# Altium schematic sheet Sheet2.SchDoc: =Name-1str
size 594 x 420 mm; SheetNumber: номер страницы; Вид изделия: Документация; Раздел: Документация; Код документа: Э3; Вид документа: Схема электрическая принципиальная; Класс документа: Конструкторский документ; Создавать изделие в PLM: Yes; DocumentCode: Э3; DocumentView: Схема электрическая принципиальная; DocumentClass: Конструкторский документ; ProductView: Документация
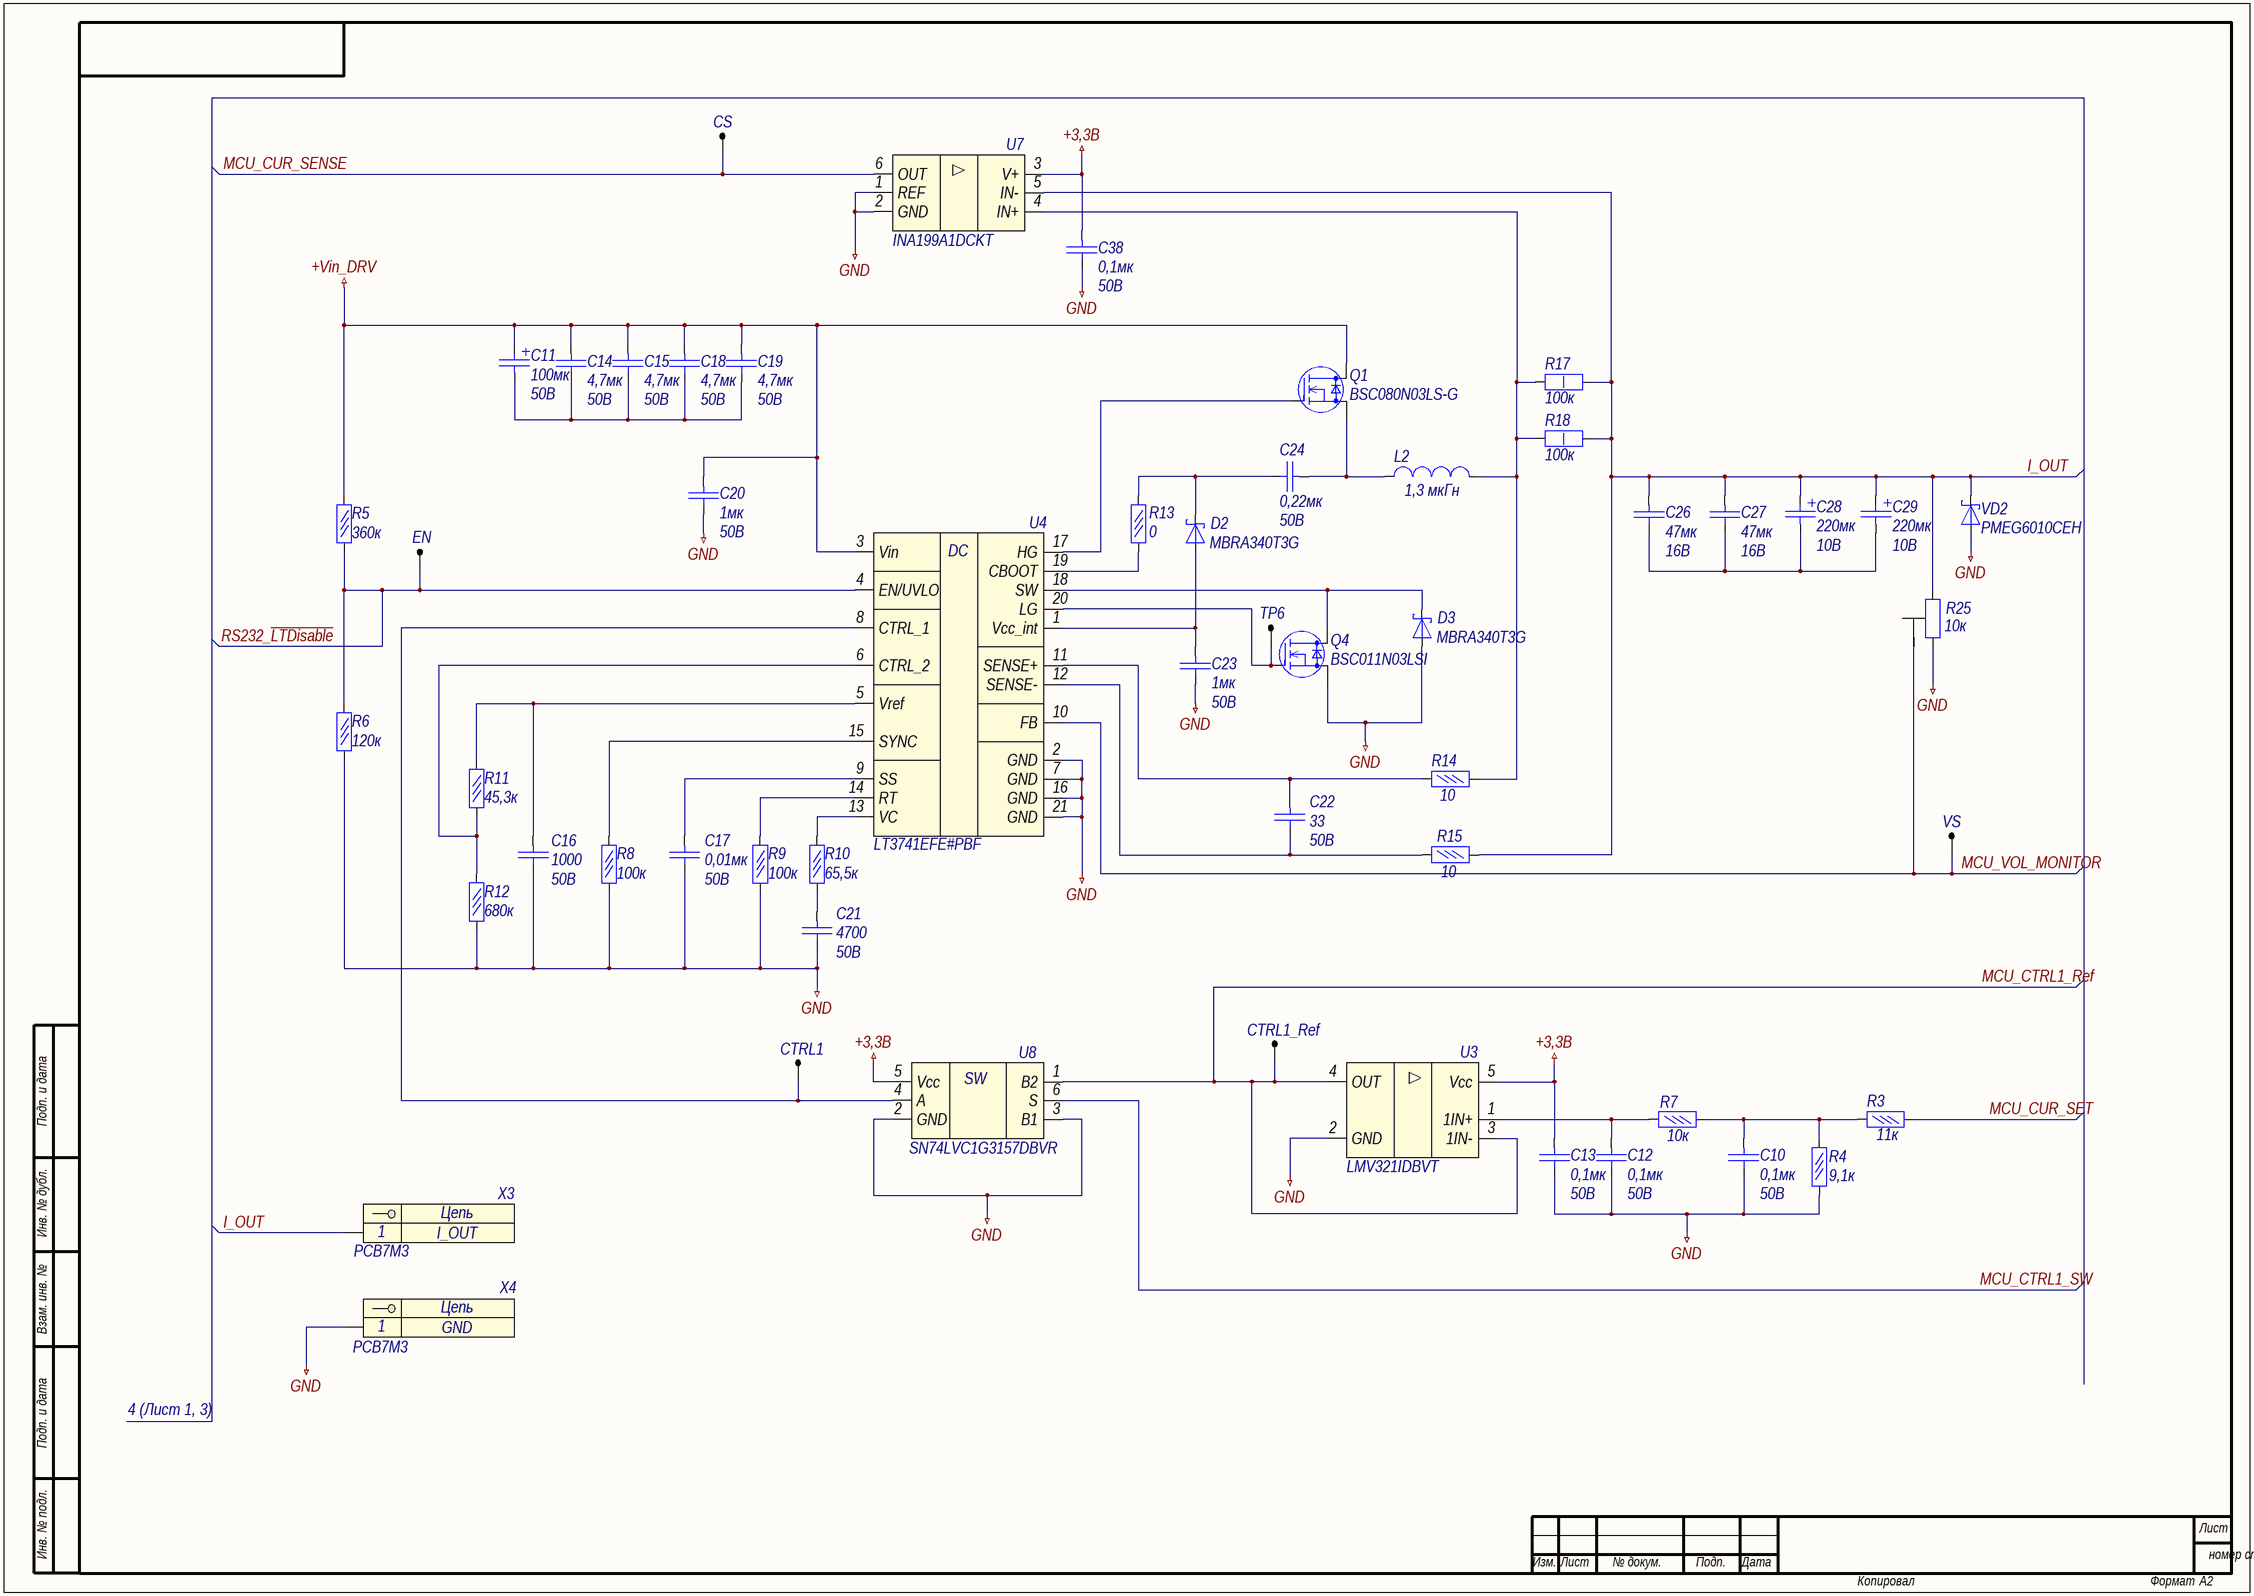
[diagram p0: Sheet2.SchDoc]

## Parts
C10  Voltage: 50В  [C0805_AA]  (hidden comment: 0,1мк)
C11  Voltage: 50В  [C0805_AA]  (hidden comment: 100мк)
C12  Voltage: 50В  [C0805_AA]  (hidden comment: 0,1мк)
C13  Voltage: 50В  [C0805_AA]  (hidden comment: 0,1мк)
C14  Voltage: 50В  [C0805_AA]  (hidden comment: 4,7мк)
C15  Voltage: 50В  [C0805_AA]  (hidden comment: 4,7мк)
C16  Voltage: 50В  [C0805_AA]  (hidden comment: 1000)
C17  Voltage: 50В  [C0805_AA]  (hidden comment: 0,01мк)
C18  Voltage: 50В  [C0805_AA]  (hidden comment: 4,7мк)
C19  Voltage: 50В  [C0805_AA]  (hidden comment: 4,7мк)
C20  Voltage: 50В  [C0805_AA]  (hidden comment: 1мк)
C21  Voltage: 50В  [C0805_AA]  (hidden comment: 4700)
C22  Voltage: 50В  [C0805_AA]  (hidden comment: 33)
C23  Voltage: 50В  [C0805_AA]  (hidden comment: 1мк)
C24  Voltage: 50В  [C0805_AA]  (hidden comment: 0,22мк)
C26  Voltage: 16В  [C0805_AA]  (hidden comment: 47мк)
C27  Voltage: 16В  [C0805_AA]  (hidden comment: 47мк)
C28  Voltage: 10В  [C0805_AA]  (hidden comment: 220мк)
C29  Voltage: 10В  [C0805_AA]  (hidden comment: 220мк)
C38  Voltage: 50В  [C0805_AA]  (hidden comment: 0,1мк)
CS  "1"  [0.5 x 1_round]  (value not drawn)
CTRL1  "1"  [0.5 x 1_round]  (value not drawn)
CTRL1_Ref  "1"  [0.5 x 1_round]  (value not drawn)
D2  MBRA340T3G  [SOD123_A]
D3  MBRA340T3G  [SOD123_A]
EN  "1"  [0.5 x 1_round]  (value not drawn)
L2  1,3 мкГн  [L0603_A]
Q1  BSC080N03LS-G  [КТ-111В-1.02]
Q4  BSC011N03LSI  [КТ-111В-1.02]
R3  11к  [R1206]
R4  9,1к  [R1206]
R5  360к  [R1206]
R6  120к  [R1206]
R7  10к  [R1206]
R8  100к  [R1206]
R9  100к  [R1206]
R10  65,5к  [R1206]
R11  45,3к  [R1206]
R12  680к  [R1206]
R13  0  [R1206]
R14  10  [R1206]
R15  10  [R1206]
R17  100к  [R1206]
R18  100к  [R1206]
R25  10к
TP6  "1"  [0.5 x 1_round]  (value not drawn)
U3  LMV321IDBVT
U4  LT3741EFE#PBF
U7  INA199A1DCKT
U8  SN74LVC1G3157DBVR
VD2  PMEG6010CEH  [SOD123_A]
VS  "1"  [0.5 x 1_round]  (value not drawn)
X3  PCB7M3
X4  PCB7M3

## Nets
+3,3В: C13.2 C38.2 U3.5(Vcc) U7.3(V+) U8.5(Vcc)
+Vin_DRV: C11.1 C14.2 C15.2 C18.2 C19.2 C20.2 Q1.3(D) R5.2 U4.3(Vin)
GND: C10.1 C12.1 C13.1 C16.1 C17.1 C20.1 C21.1 C23.1 C38.1 D3.2(A) Q4.2(S) R4.1 R6.1 R8.1 R9.1 R12.1 R25.3 U3.2(GND) U4.2(GND) U4.7(GND) U4.16(GND) U4.21(GND) U7.1(REF) U7.2(GND) U8.2(GND) U8.3(B1) VD2.2(A) X4.1
I_OUT: C26.2 C27.2 C28.1 C29.1 R15.2 R17.2 R18.2 R25.1 U7.5(IN-) VD2.1(K) X3.1
MCU_CTRL1_Ref: CTRL1_Ref.1 U3.3(1IN-) U3.4(OUT) U8.1(B2)
MCU_CTRL1_SW: U8.6(S)
MCU_CUR_SENSE: CS.1 U7.6(OUT)
MCU_CUR_SET: R3.1
MCU_VOL_MONITOR: R25.2 U4.10(FB) VS.1
RS232_~{LTDisable}: EN.1 R5.1 R6.2 U4.4(EN/UVLO)
NetC10_2: C10.2 R3.2 R4.2 R7.1
NetC11_2: C11.2 C14.1 C15.1 C18.1 C19.1
NetC12_2: C12.2 R7.2 U3.1(1IN+)
NetC16_2: C16.2 R11.2 U4.5(Vref)
NetC17_2: C17.2 U4.9(SS)
NetC21_2: C21.2 R10.1
NetC22_1: C22.1 R15.1 U4.12(SENSE-)
NetC22_2: C22.2 R14.1 U4.11(SENSE+)
NetC23_2: C23.2 D2.2(A) U4.1(Vcc_int)
NetC24_1: C24.1 D2.1(K) R13.2
NetC24_2: C24.2 L2.1 Q1.2(S)
NetC26_1: C26.1 C27.1 C28.2 C29.2
NetCTRL1_1: CTRL1.1 U4.8(CTRL_1) U8.4(A)
NetD3_1: D3.1(K) Q4.3(D) U4.18(SW)
NetL2_2: L2.2 R14.2 R17.1 R18.1 U7.4(IN+)
NetQ1_1: Q1.1(G) U4.17(HG)
NetQ4_1: Q4.1(G) TP6.1 U4.20(LG)
NetR8_2: R8.2 U4.15(SYNC)
NetR9_2: R9.2 U4.14(RT)
NetR10_2: R10.2 U4.13(VC)
NetR11_1: R11.1 R12.2 U4.6(CTRL_2)
NetR13_1: R13.1 U4.19(CBOOT)

## Notes on the sheet
- 4 (Лист 1, 3)
- Подп. и дата
- Инв. № дубл.
- Взам. инв. №
- Инв. № подл.
- Лист
- Изм.
- № докум.
- Подп.
- Дата
- Копировал
- Формат
- А2
- (in symbol LT3741) DC
- (in symbol SN74LVC1G3157) SW
- (in symbol x1-k) Цепь

## Library data of the parts
C10 C12 C13 C38 = Конденсатор кер.: Name: CC0603KRX7R9BB104; Value: 0,1мк
C11 = Конденсатор поляризованный: Конденсатор пол.; Name: EEHZC1H101P; Value: 100мк
C14 C15 C18 C19 = Конденсатор кер.: Name: C1210C475K5RACTU; Value: 4,7мк
C16 = Конденсатор кер.: Name: CC0603KRX7R9BB102; Value: 1000
C17 = Конденсатор кер.: Name: CC0603KRX7R9BB103; Value: 0,01мк
C20 C23 = Конденсатор кер.: Name: 08055D105KAT2A; Value: 1мк
C21 = Конденсатор кер.: Name: CC0603KPX7R9BB472; Value: 4700
C22 = Конденсатор кер.: Name: CC0603KRX7R9BB333; Value: 33
C24 = Конденсатор кер.: Name: CC0603ZRY5V9BB224; Value: 0,22мк
C26 C27 = Конденсатор кер.: Name: C1210C476M4PACTU; Value: 47мк
C28 C29 = Конденсатор поляризованный: Конденсатор пол.; Name: EEE-FP1A221AP; Value: 220мк
CS CTRL1 CTRL1_Ref EN TP6 VS = TestPoint: Test point; Comment_1: "1"
D2 D3 VD2 = DiodeSchottky: Диод Шоттки
  D2 D3: Name: MBRA340T3G
  VD2: Name: PMEG6010CEH
L2 = Inductor: Катушка индуктивности; Name: 7443551130; Value: 1,3 мкГн
Q1 Q4 = N-Mosfet: N-канальный транзистор; Vgs: *; Rds: *; Vds: *
  Q1: Name: BSC080N03LS-G
  Q4: Name: BSC011N03LSI
R3 = Резистор  0,05Вт: Резистор 0,05Вт; Name: RC0603FR-0711KL; Power rating: 0,05Вт; Value: 11к
R4 = Резистор  0,05Вт: Резистор 0,05Вт; Name: 'RC0603FR-079K1L; Power rating: 0,05Вт; Value: 9,1к
R5 = Резистор  0,05Вт: Резистор 0,05Вт; Name: RC0603FR-07360KL; Power rating: 0,05Вт; Value: 360к
R6 = Резистор  0,05Вт: Резистор 0,05Вт; Name: RC0603FR-07120KL; Power rating: 0,05Вт; Value: 120к
R7 = Резистор  0,05Вт: Резистор 0,05Вт; Name: RC0603FR-0710KL; Power rating: 0,05Вт; Value: 10к
R8 R9 = Резистор  0,05Вт: Резистор 0,05Вт; Name: RC0603FR-07100KL; Power rating: 0,05Вт; Value: 100к
R10 = Резистор  0,05Вт: Резистор 0,05Вт; Name: RT0603DRD0765K5L; Power rating: 0,05Вт; Value: 65,5к
R11 = Резистор  0,05Вт: Резистор 0,05Вт; Name: RC0603FR-0745K3L; Power rating: 0,05Вт; Value: 45,3к
R12 = Резистор  0,05Вт: Резистор 0,05Вт; Name: RC0603FR-07680KL; Power rating: 0,05Вт; Value: 680к
R13 = Резистор  0,05Вт: Резистор 0,05Вт; Name: 'RC0603FR-070RL; Power rating: 0,05Вт; Value: 0
R14 R15 = Резистор  0,05Вт: Резистор 0,05Вт; Name: RC0603FR-0710RL; Power rating: 0,05Вт; Value: 10
R17 R18 = Резистор  1Вт: Name: CRCW2512100KFKEG; Power rating: 1Вт; Value: 100к
R25 = Potentiometer
U3 = LMV321: Операционный усилитель Rail-to-rail
U4 = LT3741: Step-Down Controller, Constant Voltage
U7 = INA199: Voltage output current shunt monitor
U8 = SN74LVC1G3157: Аналоговый переключатель, двухпозиционный
X3 = x1-k: Разъем - 1 конт. клемма; Contact_1: I_OUT; Name: PCB7M3
X4 = x1-k: Разъем - 1 конт. клемма; Contact_1: GND; Name: PCB7M3